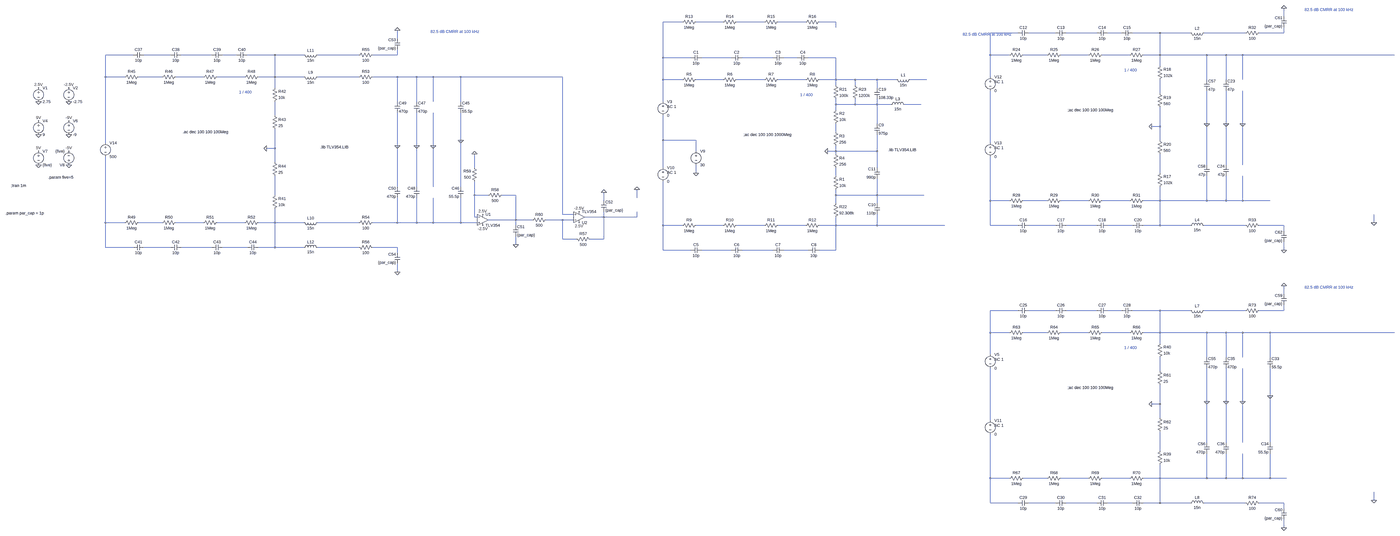
[diagram p0: schematic redirect_ratio_analysis_ac.asc, whole sheet]
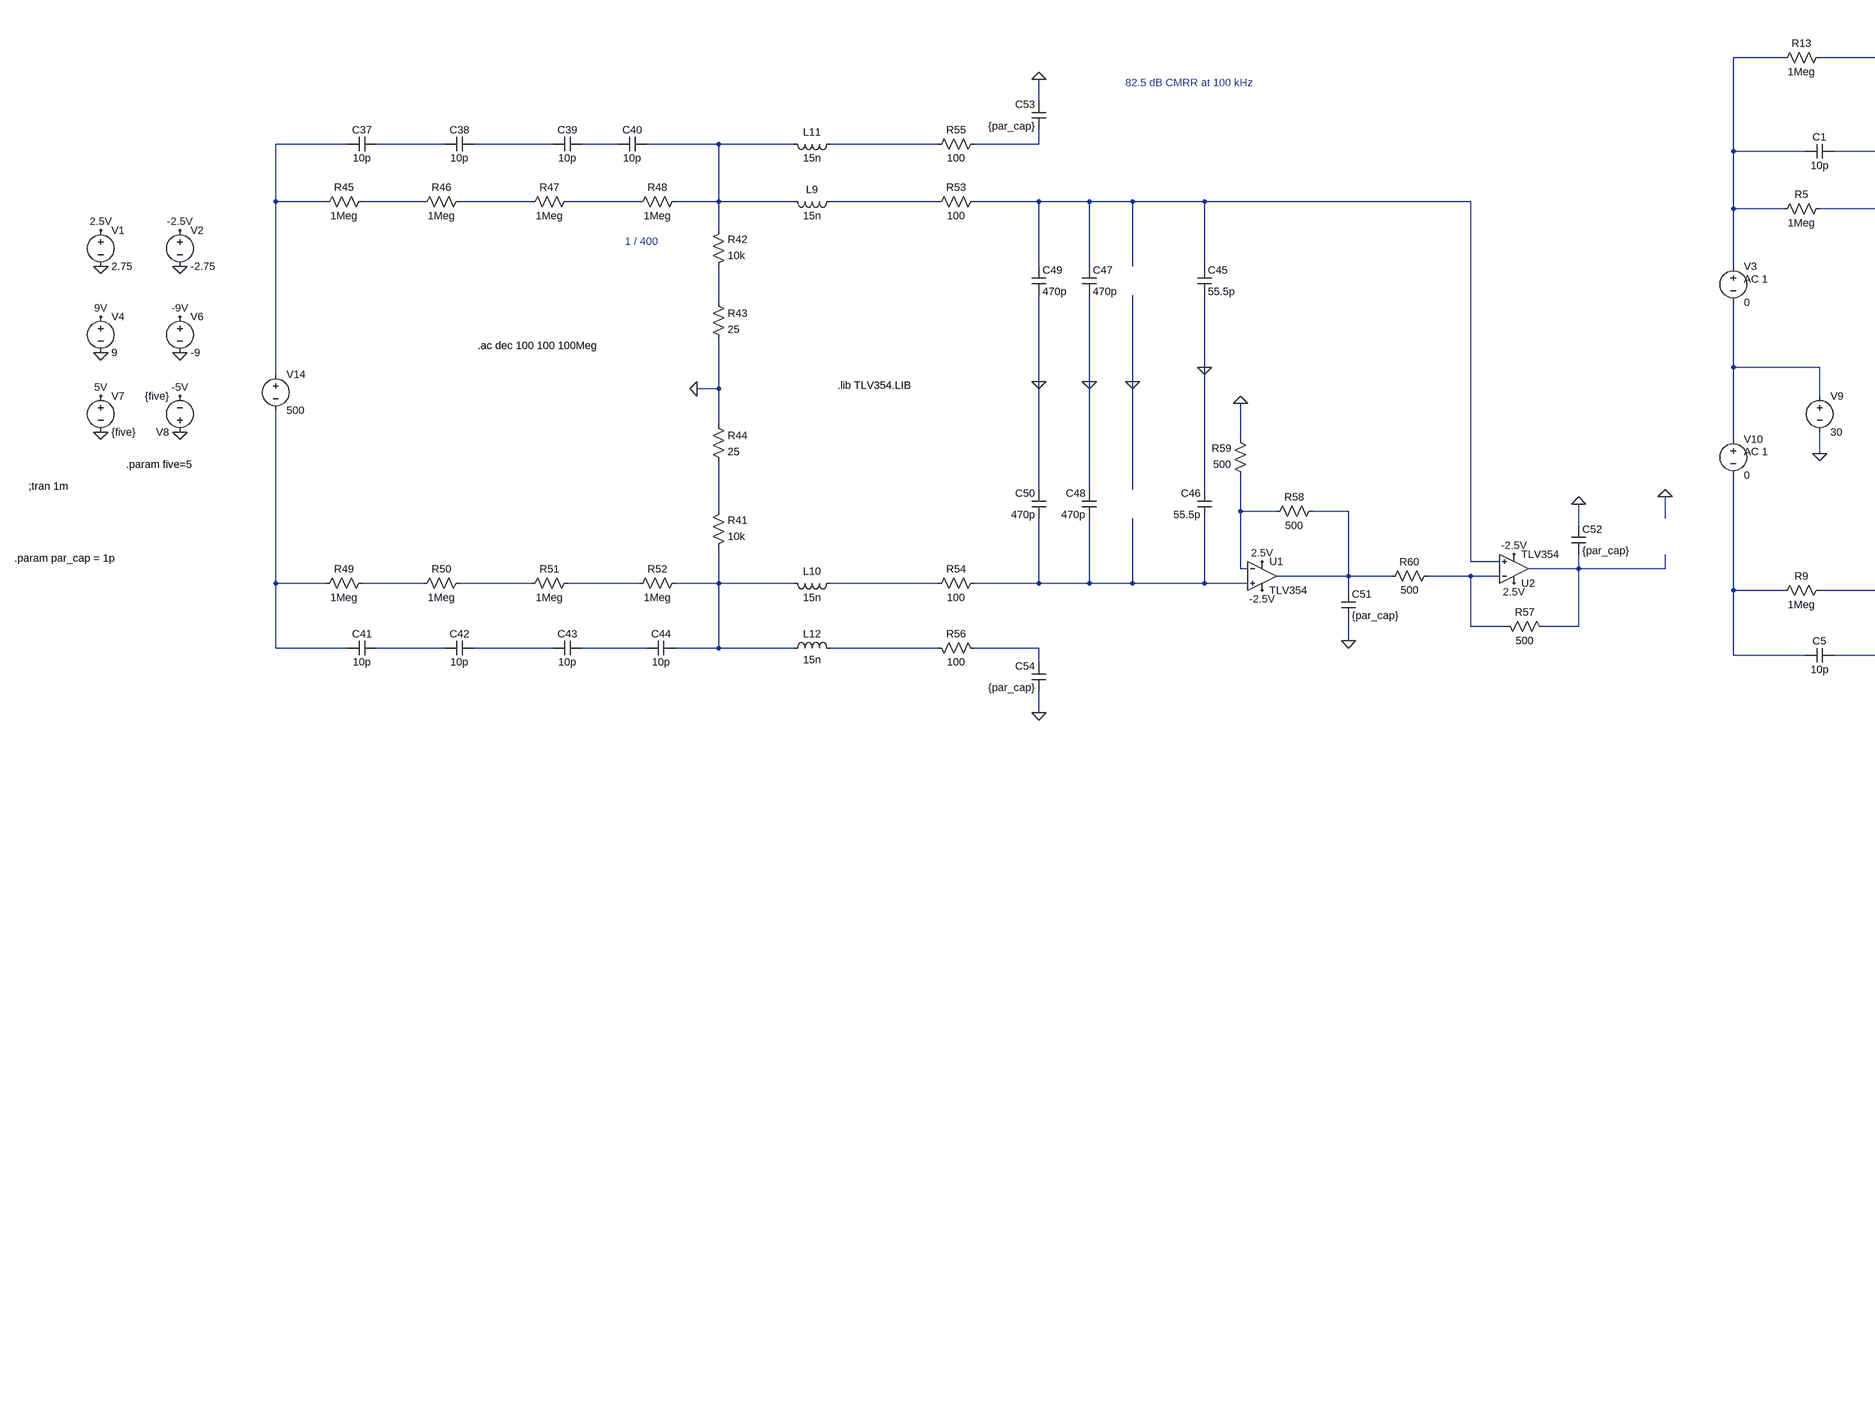
[diagram p1: schematic redirect_ratio_analysis_ac.asc, part, row 1 of 1, column 1 of 2]
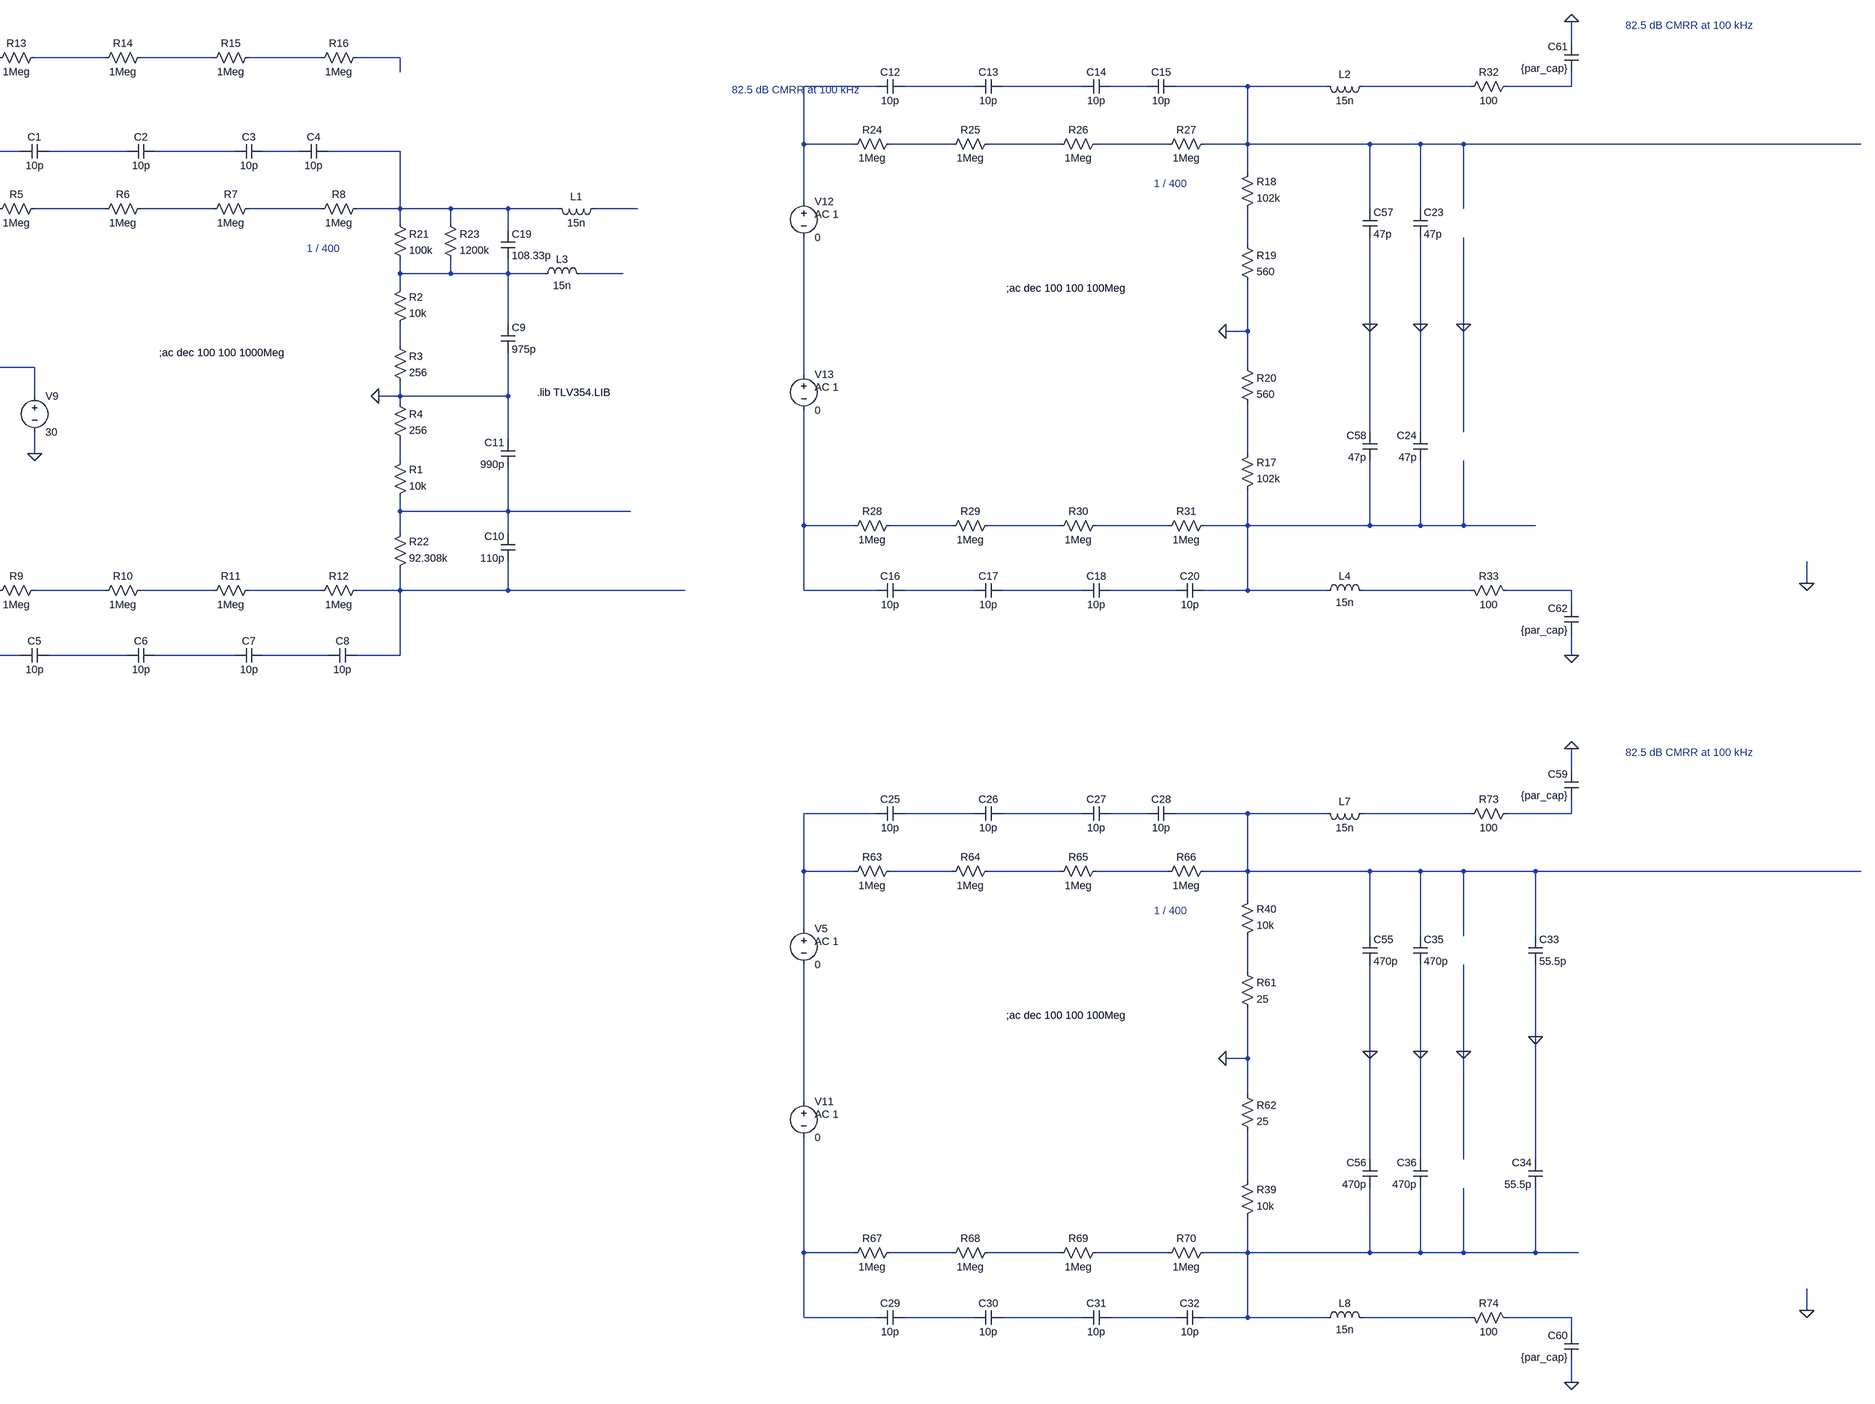
[diagram p2: schematic redirect_ratio_analysis_ac.asc, part, row 1 of 1, column 2 of 2]
redirect_ratio_analysis_ac.asc, the LTspice schematic file:
Version 4
SHEET 1 9060 2628
WIRE 7648 -672 7648 -720
WIRE 3888 -640 3776 -640
WIRE 4128 -640 3968 -640
WIRE 4368 -640 4208 -640
WIRE 4608 -640 4448 -640
WIRE 4784 -640 4688 -640
WIRE 4784 -608 4784 -640
WIRE 6048 -576 5888 -576
WIRE 6288 -576 6112 -576
WIRE 6528 -576 6352 -576
WIRE 6672 -576 6592 -576
WIRE 6896 -576 6736 -576
WIRE 7104 -576 6896 -576
WIRE 7424 -576 7184 -576
WIRE 7648 -576 7648 -608
WIRE 7648 -576 7504 -576
WIRE 2144 -544 2144 -592
WIRE 544 -448 384 -448
WIRE 784 -448 608 -448
WIRE 1024 -448 848 -448
WIRE 1168 -448 1088 -448
WIRE 1392 -448 1232 -448
WIRE 1600 -448 1392 -448
WIRE 1920 -448 1680 -448
WIRE 2144 -448 2144 -480
WIRE 2144 -448 2000 -448
WIRE 5888 -448 5888 -576
WIRE 6000 -448 5888 -448
WIRE 6240 -448 6080 -448
WIRE 6480 -448 6320 -448
WIRE 6720 -448 6560 -448
WIRE 6896 -448 6896 -576
WIRE 6896 -448 6800 -448
WIRE 7200 -448 6896 -448
WIRE 7312 -448 7200 -448
WIRE 7408 -448 7312 -448
WIRE 8608 -448 7408 -448
WIRE 3776 -432 3776 -640
WIRE 3936 -432 3776 -432
WIRE 4176 -432 4000 -432
WIRE 4416 -432 4240 -432
WIRE 4560 -432 4480 -432
WIRE 4784 -432 4624 -432
WIRE 6896 -384 6896 -448
WIRE 384 -320 384 -448
WIRE 496 -320 384 -320
WIRE 736 -320 576 -320
WIRE 976 -320 816 -320
WIRE 1216 -320 1056 -320
WIRE 1392 -320 1392 -448
WIRE 1392 -320 1296 -320
WIRE 1600 -320 1392 -320
WIRE 1920 -320 1680 -320
WIRE 2144 -320 2000 -320
WIRE 2256 -320 2144 -320
WIRE 2352 -320 2256 -320
WIRE 2512 -320 2352 -320
WIRE 3104 -320 2512 -320
WIRE 5888 -320 5888 -448
WIRE 3776 -304 3776 -432
WIRE 3888 -304 3776 -304
WIRE 4128 -304 3968 -304
WIRE 4368 -304 4208 -304
WIRE 4608 -304 4448 -304
WIRE 4784 -304 4784 -432
WIRE 4784 -304 4688 -304
WIRE 4896 -304 4784 -304
WIRE 5024 -304 4896 -304
WIRE 5136 -304 5024 -304
WIRE 5312 -304 5216 -304
WIRE 7200 -304 7200 -448
WIRE 7312 -304 7312 -448
WIRE 7408 -304 7408 -448
WIRE 4784 -272 4784 -304
WIRE 4896 -272 4896 -304
WIRE 1392 -256 1392 -320
WIRE 5024 -256 5024 -304
WIRE 6896 -224 6896 -304
WIRE 2144 -176 2144 -320
WIRE 2256 -176 2256 -320
WIRE 2352 -176 2352 -320
WIRE 2512 -176 2512 -320
WIRE 3776 -176 3776 -304
WIRE 4784 -160 4784 -192
WIRE 4896 -160 4896 -192
WIRE 4896 -160 4784 -160
WIRE 5024 -160 5024 -192
WIRE 5024 -160 4896 -160
WIRE 5104 -160 5024 -160
WIRE 5280 -160 5184 -160
WIRE 4784 -128 4784 -160
WIRE 1392 -96 1392 -176
WIRE 5024 -48 5024 -160
WIRE 7200 -48 7200 -240
WIRE 7312 -48 7312 -240
WIRE 7408 -48 7408 -240
WIRE 6896 -32 6896 -144
WIRE 6896 -32 6848 -32
WIRE 4784 0 4784 -48
WIRE 2512 48 2512 -112
WIRE 3776 48 3776 -96
WIRE 3968 48 3776 48
WIRE 6896 48 6896 -32
WIRE 384 64 384 -320
WIRE 5888 64 5888 -240
WIRE 2144 80 2144 -112
WIRE 2256 80 2256 -112
WIRE 2352 80 2352 -112
WIRE 1392 96 1392 -16
WIRE 1392 96 1344 96
WIRE 3968 112 3968 48
WIRE 4784 112 4784 80
WIRE 4784 112 4736 112
WIRE 5024 112 5024 16
WIRE 5024 112 4784 112
WIRE 4784 128 4784 112
WIRE 1392 176 1392 96
WIRE 7200 192 7200 -48
WIRE 7312 192 7312 -48
WIRE 7408 192 7408 -48
WIRE 2592 208 2592 128
WIRE 3776 208 3776 48
WIRE 5024 208 5024 112
WIRE 3968 240 3968 192
WIRE 6896 240 6896 128
WIRE 4784 256 4784 208
WIRE 2144 320 2144 80
WIRE 2256 320 2256 80
WIRE 2352 320 2352 80
WIRE 2512 320 2512 48
WIRE 1392 368 1392 256
WIRE 2592 368 2592 288
WIRE 2672 368 2592 368
WIRE 2832 368 2752 368
WIRE 4784 368 4784 336
WIRE 5024 368 5024 272
WIRE 5024 368 4784 368
WIRE 5296 368 5024 368
WIRE 3536 384 3536 336
WIRE 3344 400 3344 352
WIRE 5888 400 5888 144
WIRE 6000 400 5888 400
WIRE 6240 400 6080 400
WIRE 6480 400 6320 400
WIRE 6720 400 6560 400
WIRE 6896 400 6896 320
WIRE 6896 400 6800 400
WIRE 7200 400 7200 256
WIRE 7200 400 6896 400
WIRE 7312 400 7312 256
WIRE 7312 400 7200 400
WIRE 7408 400 7408 256
WIRE 7408 400 7312 400
WIRE 7568 400 7408 400
WIRE 4784 416 4784 368
WIRE 5024 416 5024 368
WIRE 3104 480 3104 -320
WIRE 3168 480 3104 480
WIRE 2592 496 2592 368
WIRE 2608 496 2592 496
WIRE 3344 496 3344 464
WIRE 3344 496 3232 496
WIRE 3536 496 3536 464
WIRE 3536 496 3344 496
WIRE 2832 512 2832 368
WIRE 2832 512 2672 512
WIRE 2928 512 2832 512
WIRE 3104 512 3008 512
WIRE 3168 512 3104 512
WIRE 384 528 384 144
WIRE 496 528 384 528
WIRE 736 528 576 528
WIRE 976 528 816 528
WIRE 1216 528 1056 528
WIRE 1392 528 1392 448
WIRE 1392 528 1296 528
WIRE 1600 528 1392 528
WIRE 1920 528 1680 528
WIRE 2144 528 2144 384
WIRE 2144 528 2000 528
WIRE 2256 528 2256 384
WIRE 2256 528 2144 528
WIRE 2352 528 2352 384
WIRE 2352 528 2256 528
WIRE 2512 528 2512 384
WIRE 2512 528 2352 528
WIRE 2608 528 2512 528
WIRE 8336 528 8336 480
WIRE 2832 544 2832 512
WIRE 3776 544 3776 288
WIRE 3888 544 3776 544
WIRE 4128 544 3968 544
WIRE 4368 544 4208 544
WIRE 4608 544 4448 544
WIRE 4784 544 4784 496
WIRE 4784 544 4688 544
WIRE 5024 544 5024 480
WIRE 5024 544 4784 544
WIRE 5424 544 5024 544
WIRE 5888 544 5888 400
WIRE 6048 544 5888 544
WIRE 6288 544 6112 544
WIRE 6528 544 6352 544
WIRE 6736 544 6592 544
WIRE 6896 544 6896 400
WIRE 6896 544 6800 544
WIRE 7104 544 6896 544
WIRE 7424 544 7184 544
WIRE 7648 544 7504 544
WIRE 7648 576 7648 544
WIRE 3104 624 3104 512
WIRE 3184 624 3104 624
WIRE 3344 624 3344 496
WIRE 3344 624 3264 624
WIRE 2832 656 2832 608
WIRE 384 672 384 528
WIRE 544 672 384 672
WIRE 784 672 608 672
WIRE 1024 672 848 672
WIRE 1232 672 1088 672
WIRE 1392 672 1392 528
WIRE 1392 672 1296 672
WIRE 1600 672 1392 672
WIRE 1920 672 1680 672
WIRE 2144 672 2000 672
WIRE 3776 688 3776 544
WIRE 3936 688 3776 688
WIRE 4176 688 4000 688
WIRE 4416 688 4240 688
WIRE 4624 688 4480 688
WIRE 4784 688 4784 544
WIRE 4784 688 4688 688
WIRE 7648 688 7648 640
WIRE 2144 704 2144 672
WIRE 2144 816 2144 768
WIRE 7648 944 7648 896
WIRE 6048 1040 5888 1040
WIRE 6288 1040 6112 1040
WIRE 6528 1040 6352 1040
WIRE 6672 1040 6592 1040
WIRE 6896 1040 6736 1040
WIRE 7104 1040 6896 1040
WIRE 7424 1040 7184 1040
WIRE 7648 1040 7648 1008
WIRE 7648 1040 7504 1040
WIRE 5888 1168 5888 1040
WIRE 6000 1168 5888 1168
WIRE 6240 1168 6080 1168
WIRE 6480 1168 6320 1168
WIRE 6720 1168 6560 1168
WIRE 6896 1168 6896 1040
WIRE 6896 1168 6800 1168
WIRE 7200 1168 6896 1168
WIRE 7312 1168 7200 1168
WIRE 7408 1168 7312 1168
WIRE 7568 1168 7408 1168
WIRE 8608 1168 7568 1168
WIRE 6896 1232 6896 1168
WIRE 5888 1296 5888 1168
WIRE 7200 1312 7200 1168
WIRE 7312 1312 7312 1168
WIRE 7408 1312 7408 1168
WIRE 7568 1312 7568 1168
WIRE 6896 1392 6896 1312
WIRE 7568 1536 7568 1376
WIRE 7200 1568 7200 1376
WIRE 7312 1568 7312 1376
WIRE 7408 1568 7408 1376
WIRE 6896 1584 6896 1472
WIRE 6896 1584 6848 1584
WIRE 6896 1664 6896 1584
WIRE 5888 1680 5888 1376
WIRE 7200 1808 7200 1568
WIRE 7312 1808 7312 1568
WIRE 7408 1808 7408 1568
WIRE 7568 1808 7568 1536
WIRE 6896 1856 6896 1744
WIRE 5888 2016 5888 1760
WIRE 6000 2016 5888 2016
WIRE 6240 2016 6080 2016
WIRE 6480 2016 6320 2016
WIRE 6720 2016 6560 2016
WIRE 6896 2016 6896 1936
WIRE 6896 2016 6800 2016
WIRE 7200 2016 7200 1872
WIRE 7200 2016 6896 2016
WIRE 7312 2016 7312 1872
WIRE 7312 2016 7200 2016
WIRE 7408 2016 7408 1872
WIRE 7408 2016 7312 2016
WIRE 7568 2016 7568 1872
WIRE 7568 2016 7408 2016
WIRE 7664 2016 7568 2016
WIRE 8336 2144 8336 2096
WIRE 5888 2160 5888 2016
WIRE 6048 2160 5888 2160
WIRE 6288 2160 6112 2160
WIRE 6528 2160 6352 2160
WIRE 6736 2160 6592 2160
WIRE 6896 2160 6896 2016
WIRE 6896 2160 6800 2160
WIRE 7104 2160 6896 2160
WIRE 7424 2160 7184 2160
WIRE 7648 2160 7504 2160
WIRE 7648 2192 7648 2160
WIRE 7648 2304 7648 2256
FLAG -80 -176 0
FLAG -80 -256 2.5V
FLAG 96 -176 0
FLAG 96 -256 -2.5V
FLAG -80 16 0
FLAG -80 -64 9V
FLAG 96 16 0
FLAG 96 -64 -9V
FLAG -80 192 0
FLAG -80 112 5V
FLAG 96 192 0
FLAG 96 112 -5V
FLAG 1344 96 0
FLAG 2352 80 0
FLAG 2512 48 0
FLAG 3200 528 2.5V
FLAG 3200 464 -2.5V
FLAG 2256 80 0
FLAG 2640 480 2.5V
FLAG 2640 544 -2.5V
FLAG 2144 80 0
FLAG 2832 656 0
FLAG 3344 352 0
FLAG 2144 -592 0
FLAG 2144 816 0
FLAG 3536 336 0
FLAG 2592 128 0
FLAG 4736 112 0
FLAG 3968 240 0
FLAG 6848 1584 0
FLAG 7408 1568 0
FLAG 7568 1536 0
FLAG 7312 1568 0
FLAG 7200 1568 0
FLAG 8336 2144 0
FLAG 7648 896 0
FLAG 7648 2304 0
FLAG 6848 -32 0
FLAG 7408 -48 0
FLAG 7312 -48 0
FLAG 7200 -48 0
FLAG 8336 528 0
FLAG 7648 -720 0
FLAG 7648 688 0
SYMBOL voltage -80 -272 R0
SYMATTR InstName V1
SYMATTR Value 2.75
SYMBOL voltage 96 -272 R0
SYMATTR InstName V2
SYMATTR Value -2.75
SYMBOL voltage -80 -80 R0
SYMATTR InstName V4
SYMATTR Value 9
SYMBOL voltage 96 -80 R0
SYMATTR InstName V6
SYMATTR Value -9
SYMBOL voltage -80 96 R0
SYMATTR InstName V7
SYMATTR Value {five}
SYMBOL voltage 96 208 R180
WINDOW 123 0 0 Left 0
WINDOW 39 0 0 Left 0
SYMATTR InstName V8
SYMATTR Value {five}
SYMBOL res 1376 464 M180
WINDOW 0 36 76 Left 2
WINDOW 3 36 40 Left 2
SYMATTR InstName R41
SYMATTR Value 10k
SYMBOL cap 608 -464 R90
WINDOW 0 0 32 VBottom 2
WINDOW 3 32 32 VTop 2
SYMATTR InstName C37
SYMATTR Value 10p
SYMBOL cap 848 -464 R90
WINDOW 0 0 32 VBottom 2
WINDOW 3 32 32 VTop 2
SYMATTR InstName C38
SYMATTR Value 10p
SYMBOL cap 1088 -464 R90
WINDOW 0 0 32 VBottom 2
WINDOW 3 32 32 VTop 2
SYMATTR InstName C39
SYMATTR Value 10p
SYMBOL cap 1232 -464 R90
WINDOW 0 0 32 VBottom 2
WINDOW 3 32 32 VTop 2
SYMATTR InstName C40
SYMATTR Value 10p
SYMBOL cap 608 656 R90
WINDOW 0 0 32 VBottom 2
WINDOW 3 32 32 VTop 2
SYMATTR InstName C41
SYMATTR Value 10p
SYMBOL cap 848 656 R90
WINDOW 0 0 32 VBottom 2
WINDOW 3 32 32 VTop 2
SYMATTR InstName C42
SYMATTR Value 10p
SYMBOL cap 1088 656 R90
WINDOW 0 0 32 VBottom 2
WINDOW 3 32 32 VTop 2
SYMATTR InstName C43
SYMATTR Value 10p
SYMBOL cap 1296 656 R90
WINDOW 0 0 32 VBottom 2
WINDOW 3 32 32 VTop 2
SYMATTR InstName C44
SYMATTR Value 10p
SYMBOL cap 2496 -176 R0
SYMATTR InstName C45
SYMATTR Value 55.5p
SYMBOL cap 2528 384 R180
WINDOW 0 24 56 Left 2
WINDOW 3 24 8 Left 2
SYMATTR InstName C46
SYMATTR Value 55.5p
SYMBOL res 1376 -160 M180
WINDOW 0 36 76 Left 2
WINDOW 3 36 40 Left 2
SYMATTR InstName R42
SYMATTR Value 10k
SYMBOL voltage 384 48 R0
WINDOW 123 0 0 Left 0
WINDOW 39 0 0 Left 0
SYMATTR InstName V14
SYMATTR Value 500
SYMBOL cap 2240 -176 R0
SYMATTR InstName C47
SYMATTR Value 470p
SYMBOL cap 2272 384 R180
WINDOW 0 24 56 Left 2
WINDOW 3 24 8 Left 2
SYMATTR InstName C48
SYMATTR Value 470p
SYMBOL res 1376 -112 R0
SYMATTR InstName R43
SYMATTR Value 25
SYMBOL res 1376 160 R0
SYMATTR InstName R44
SYMATTR Value 25
SYMBOL cap 2128 -176 R0
SYMATTR InstName C49
SYMATTR Value 470p
SYMBOL cap 2160 384 R180
WINDOW 0 24 56 Left 2
WINDOW 3 24 8 Left 2
SYMATTR InstName C50
SYMATTR Value 470p
SYMBOL cap 2816 544 R0
SYMATTR InstName C51
SYMATTR Value {par_cap}
SYMBOL cap 3328 464 M180
WINDOW 0 24 56 Left 2
WINDOW 3 24 8 Left 2
SYMATTR InstName C52
SYMATTR Value {par_cap}
SYMBOL ind 1696 -336 R90
WINDOW 0 5 56 VBottom 2
WINDOW 3 32 56 VTop 2
SYMATTR InstName L9
SYMATTR Value 15n
SYMBOL res 592 -336 R90
WINDOW 0 0 56 VBottom 2
WINDOW 3 32 56 VTop 2
SYMATTR InstName R45
SYMATTR Value 1Meg
SYMBOL res 832 -336 R90
WINDOW 0 0 56 VBottom 2
WINDOW 3 32 56 VTop 2
SYMATTR InstName R46
SYMATTR Value 1Meg
SYMBOL res 1072 -336 R90
WINDOW 0 0 56 VBottom 2
WINDOW 3 32 56 VTop 2
SYMATTR InstName R47
SYMATTR Value 1Meg
SYMBOL res 1312 -336 R90
WINDOW 0 0 56 VBottom 2
WINDOW 3 32 56 VTop 2
SYMATTR InstName R48
SYMATTR Value 1Meg
SYMBOL res 592 512 R90
WINDOW 0 0 56 VBottom 2
WINDOW 3 32 56 VTop 2
SYMATTR InstName R49
SYMATTR Value 1Meg
SYMBOL res 832 512 R90
WINDOW 0 0 56 VBottom 2
WINDOW 3 32 56 VTop 2
SYMATTR InstName R50
SYMATTR Value 1Meg
SYMBOL res 1072 512 R90
WINDOW 0 0 56 VBottom 2
WINDOW 3 32 56 VTop 2
SYMATTR InstName R51
SYMATTR Value 1Meg
SYMBOL res 1312 512 R90
WINDOW 0 0 56 VBottom 2
WINDOW 3 32 56 VTop 2
SYMATTR InstName R52
SYMATTR Value 1Meg
SYMBOL ind 1696 512 R90
WINDOW 0 5 56 VBottom 2
WINDOW 3 32 56 VTop 2
SYMATTR InstName L10
SYMATTR Value 15n
SYMBOL res 2016 -336 R90
WINDOW 0 0 56 VBottom 2
WINDOW 3 32 56 VTop 2
SYMATTR InstName R53
SYMATTR Value 100
SYMBOL res 2016 512 R90
WINDOW 0 0 56 VBottom 2
WINDOW 3 32 56 VTop 2
SYMATTR InstName R54
SYMATTR Value 100
SYMBOL ind 1696 -464 R90
WINDOW 0 5 56 VBottom 2
WINDOW 3 32 56 VTop 2
SYMATTR InstName L11
SYMATTR Value 15n
SYMBOL res 2016 -464 R90
WINDOW 0 0 56 VBottom 2
WINDOW 3 32 56 VTop 2
SYMATTR InstName R55
SYMATTR Value 100
SYMBOL cap 2160 -480 R180
WINDOW 0 24 56 Left 2
WINDOW 3 24 8 Left 2
SYMATTR InstName C53
SYMATTR Value {par_cap}
SYMBOL ind 1696 688 M270
WINDOW 0 32 56 VTop 2
WINDOW 3 5 56 VBottom 2
SYMATTR InstName L12
SYMATTR Value 15n
SYMBOL res 2016 688 M270
WINDOW 0 32 56 VTop 2
WINDOW 3 0 56 VBottom 2
SYMATTR InstName R56
SYMATTR Value 100
SYMBOL cap 2160 704 M0
SYMATTR InstName C54
SYMATTR Value {par_cap}
SYMBOL res 3280 640 M270
WINDOW 0 32 56 VTop 2
WINDOW 3 0 56 VBottom 2
SYMATTR InstName R57
SYMATTR Value 500
SYMBOL res 2768 352 R90
WINDOW 0 0 56 VBottom 2
WINDOW 3 32 56 VTop 2
SYMATTR InstName R58
SYMATTR Value 500
SYMBOL res 2608 304 R180
WINDOW 0 36 76 Left 2
WINDOW 3 36 40 Left 2
SYMATTR InstName R59
SYMATTR Value 500
SYMBOL res 3024 496 R90
WINDOW 0 0 56 VBottom 2
WINDOW 3 32 56 VTop 2
SYMATTR InstName R60
SYMATTR Value 500
SYMBOL OpAmps\\opamp2 2640 448 R0
SYMATTR InstName U1
SYMATTR Value TLV354
SYMBOL OpAmps\\opamp2 3200 560 M180
SYMATTR InstName U2
SYMATTR Value TLV354
SYMBOL res 4768 352 M180
WINDOW 0 36 76 Left 2
WINDOW 3 36 40 Left 2
SYMATTR InstName R1
SYMATTR Value 10k
SYMBOL cap 4000 -448 R90
WINDOW 0 0 32 VBottom 2
WINDOW 3 32 32 VTop 2
SYMATTR InstName C1
SYMATTR Value 10p
SYMBOL cap 4240 -448 R90
WINDOW 0 0 32 VBottom 2
WINDOW 3 32 32 VTop 2
SYMATTR InstName C2
SYMATTR Value 10p
SYMBOL cap 4480 -448 R90
WINDOW 0 0 32 VBottom 2
WINDOW 3 32 32 VTop 2
SYMATTR InstName C3
SYMATTR Value 10p
SYMBOL cap 4624 -448 R90
WINDOW 0 0 32 VBottom 2
WINDOW 3 32 32 VTop 2
SYMATTR InstName C4
SYMATTR Value 10p
SYMBOL cap 4000 672 R90
WINDOW 0 0 32 VBottom 2
WINDOW 3 32 32 VTop 2
SYMATTR InstName C5
SYMATTR Value 10p
SYMBOL cap 4240 672 R90
WINDOW 0 0 32 VBottom 2
WINDOW 3 32 32 VTop 2
SYMATTR InstName C6
SYMATTR Value 10p
SYMBOL cap 4480 672 R90
WINDOW 0 0 32 VBottom 2
WINDOW 3 32 32 VTop 2
SYMATTR InstName C7
SYMATTR Value 10p
SYMBOL cap 4688 672 R90
WINDOW 0 0 32 VBottom 2
WINDOW 3 32 32 VTop 2
SYMATTR InstName C8
SYMATTR Value 10p
SYMBOL res 4768 -32 M180
WINDOW 0 36 76 Left 2
WINDOW 3 36 40 Left 2
SYMATTR InstName R2
SYMATTR Value 10k
SYMBOL voltage 3776 -192 R0
WINDOW 123 24 44 Left 2
WINDOW 39 0 0 Left 0
SYMATTR Value2 AC 1
SYMATTR InstName V3
SYMATTR Value 0
SYMBOL res 4768 -16 R0
SYMATTR InstName R3
SYMATTR Value 256
SYMBOL ind 5232 -320 R90
WINDOW 0 5 56 VBottom 2
WINDOW 3 32 56 VTop 2
SYMATTR InstName L1
SYMATTR Value 15n
SYMBOL res 3984 -320 R90
WINDOW 0 0 56 VBottom 2
WINDOW 3 32 56 VTop 2
SYMATTR InstName R5
SYMATTR Value 1Meg
SYMBOL res 4224 -320 R90
WINDOW 0 0 56 VBottom 2
WINDOW 3 32 56 VTop 2
SYMATTR InstName R6
SYMATTR Value 1Meg
SYMBOL res 4464 -320 R90
WINDOW 0 0 56 VBottom 2
WINDOW 3 32 56 VTop 2
SYMATTR InstName R7
SYMATTR Value 1Meg
SYMBOL res 4704 -320 R90
WINDOW 0 0 56 VBottom 2
WINDOW 3 32 56 VTop 2
SYMATTR InstName R8
SYMATTR Value 1Meg
SYMBOL res 3984 528 R90
WINDOW 0 0 56 VBottom 2
WINDOW 3 32 56 VTop 2
SYMATTR InstName R9
SYMATTR Value 1Meg
SYMBOL res 4224 528 R90
WINDOW 0 0 56 VBottom 2
WINDOW 3 32 56 VTop 2
SYMATTR InstName R10
SYMATTR Value 1Meg
SYMBOL res 4464 528 R90
WINDOW 0 0 56 VBottom 2
WINDOW 3 32 56 VTop 2
SYMATTR InstName R11
SYMATTR Value 1Meg
SYMBOL res 4704 528 R90
WINDOW 0 0 56 VBottom 2
WINDOW 3 32 56 VTop 2
SYMATTR InstName R12
SYMATTR Value 1Meg
SYMBOL ind 5200 -144 M270
WINDOW 0 32 56 VTop 2
WINDOW 3 5 56 VBottom 2
SYMATTR InstName L3
SYMATTR Value 15n
SYMBOL voltage 3968 96 R0
WINDOW 123 0 0 Left 0
WINDOW 39 0 0 Left 0
SYMATTR InstName V9
SYMATTR Value 30
SYMBOL res 4768 112 R0
SYMATTR InstName R4
SYMATTR Value 256
SYMBOL res 4768 512 M180
WINDOW 0 36 76 Left 2
WINDOW 3 36 40 Left 2
SYMATTR InstName R22
SYMATTR Value 92.308k
SYMBOL res 4768 -288 R0
SYMATTR InstName R21
SYMATTR Value 100k
SYMBOL res 4880 -288 R0
SYMATTR InstName R23
SYMATTR Value 1200k
SYMBOL cap 5008 -256 R0
SYMATTR InstName C19
SYMATTR Value 108.33p
SYMBOL cap 5008 -48 R0
SYMATTR InstName C9
SYMATTR Value 975p
SYMBOL cap 5040 480 R180
WINDOW 0 24 56 Left 2
WINDOW 3 24 8 Left 2
SYMATTR InstName C10
SYMATTR Value 110p
SYMBOL cap 5040 272 R180
WINDOW 0 24 56 Left 2
WINDOW 3 24 8 Left 2
SYMATTR InstName C11
SYMATTR Value 990p
SYMBOL voltage 3776 192 R0
WINDOW 123 24 44 Left 2
WINDOW 39 0 0 Left 0
SYMATTR Value2 AC 1
SYMATTR InstName V10
SYMATTR Value 0
SYMBOL res 3984 -656 R90
WINDOW 0 0 56 VBottom 2
WINDOW 3 32 56 VTop 2
SYMATTR InstName R13
SYMATTR Value 1Meg
SYMBOL res 4224 -656 R90
WINDOW 0 0 56 VBottom 2
WINDOW 3 32 56 VTop 2
SYMATTR InstName R14
SYMATTR Value 1Meg
SYMBOL res 4464 -656 R90
WINDOW 0 0 56 VBottom 2
WINDOW 3 32 56 VTop 2
SYMATTR InstName R15
SYMATTR Value 1Meg
SYMBOL res 4704 -656 R90
WINDOW 0 0 56 VBottom 2
WINDOW 3 32 56 VTop 2
SYMATTR InstName R16
SYMATTR Value 1Meg
SYMBOL res 6880 1952 M180
WINDOW 0 36 76 Left 2
WINDOW 3 36 40 Left 2
SYMATTR InstName R39
SYMATTR Value 10k
SYMBOL cap 6112 1024 R90
WINDOW 0 0 32 VBottom 2
WINDOW 3 32 32 VTop 2
SYMATTR InstName C25
SYMATTR Value 10p
SYMBOL cap 6352 1024 R90
WINDOW 0 0 32 VBottom 2
WINDOW 3 32 32 VTop 2
SYMATTR InstName C26
SYMATTR Value 10p
SYMBOL cap 6592 1024 R90
WINDOW 0 0 32 VBottom 2
WINDOW 3 32 32 VTop 2
SYMATTR InstName C27
SYMATTR Value 10p
SYMBOL cap 6736 1024 R90
WINDOW 0 0 32 VBottom 2
WINDOW 3 32 32 VTop 2
SYMATTR InstName C28
SYMATTR Value 10p
SYMBOL cap 6112 2144 R90
WINDOW 0 0 32 VBottom 2
WINDOW 3 32 32 VTop 2
SYMATTR InstName C29
SYMATTR Value 10p
SYMBOL cap 6352 2144 R90
WINDOW 0 0 32 VBottom 2
WINDOW 3 32 32 VTop 2
SYMATTR InstName C30
SYMATTR Value 10p
SYMBOL cap 6592 2144 R90
WINDOW 0 0 32 VBottom 2
WINDOW 3 32 32 VTop 2
SYMATTR InstName C31
SYMATTR Value 10p
SYMBOL cap 6800 2144 R90
WINDOW 0 0 32 VBottom 2
WINDOW 3 32 32 VTop 2
SYMATTR InstName C32
SYMATTR Value 10p
SYMBOL cap 7552 1312 R0
SYMATTR InstName C33
SYMATTR Value 55.5p
SYMBOL cap 7584 1872 R180
WINDOW 0 24 56 Left 2
WINDOW 3 24 8 Left 2
SYMATTR InstName C34
SYMATTR Value 55.5p
SYMBOL res 6880 1328 M180
WINDOW 0 36 76 Left 2
WINDOW 3 36 40 Left 2
SYMATTR InstName R40
SYMATTR Value 10k
SYMBOL cap 7296 1312 R0
SYMATTR InstName C35
SYMATTR Value 470p
SYMBOL cap 7328 1872 R180
WINDOW 0 24 56 Left 2
WINDOW 3 24 8 Left 2
SYMATTR InstName C36
SYMATTR Value 470p
SYMBOL res 6880 1376 R0
SYMATTR InstName R61
SYMATTR Value 25
SYMBOL res 6880 1648 R0
SYMATTR InstName R62
SYMATTR Value 25
SYMBOL cap 7184 1312 R0
SYMATTR InstName C55
SYMATTR Value 470p
SYMBOL cap 7216 1872 R180
WINDOW 0 24 56 Left 2
WINDOW 3 24 8 Left 2
SYMATTR InstName C56
SYMATTR Value 470p
SYMBOL res 6096 1152 R90
WINDOW 0 0 56 VBottom 2
WINDOW 3 32 56 VTop 2
SYMATTR InstName R63
SYMATTR Value 1Meg
SYMBOL res 6336 1152 R90
WINDOW 0 0 56 VBottom 2
WINDOW 3 32 56 VTop 2
SYMATTR InstName R64
SYMATTR Value 1Meg
SYMBOL res 6576 1152 R90
WINDOW 0 0 56 VBottom 2
WINDOW 3 32 56 VTop 2
SYMATTR InstName R65
SYMATTR Value 1Meg
SYMBOL res 6816 1152 R90
WINDOW 0 0 56 VBottom 2
WINDOW 3 32 56 VTop 2
SYMATTR InstName R66
SYMATTR Value 1Meg
SYMBOL res 6096 2000 R90
WINDOW 0 0 56 VBottom 2
WINDOW 3 32 56 VTop 2
SYMATTR InstName R67
SYMATTR Value 1Meg
SYMBOL res 6336 2000 R90
WINDOW 0 0 56 VBottom 2
WINDOW 3 32 56 VTop 2
SYMATTR InstName R68
SYMATTR Value 1Meg
SYMBOL res 6576 2000 R90
WINDOW 0 0 56 VBottom 2
WINDOW 3 32 56 VTop 2
SYMATTR InstName R69
SYMATTR Value 1Meg
SYMBOL res 6816 2000 R90
WINDOW 0 0 56 VBottom 2
WINDOW 3 32 56 VTop 2
SYMATTR InstName R70
SYMATTR Value 1Meg
SYMBOL ind 7200 1024 R90
WINDOW 0 5 56 VBottom 2
WINDOW 3 32 56 VTop 2
SYMATTR InstName L7
SYMATTR Value 15n
SYMBOL res 7520 1024 R90
WINDOW 0 0 56 VBottom 2
WINDOW 3 32 56 VTop 2
SYMATTR InstName R73
SYMATTR Value 100
SYMBOL cap 7664 1008 R180
WINDOW 0 24 56 Left 2
WINDOW 3 24 8 Left 2
SYMATTR InstName C59
SYMATTR Value {par_cap}
SYMBOL ind 7200 2176 M270
WINDOW 0 32 56 VTop 2
WINDOW 3 5 56 VBottom 2
SYMATTR InstName L8
SYMATTR Value 15n
SYMBOL res 7520 2176 M270
WINDOW 0 32 56 VTop 2
WINDOW 3 0 56 VBottom 2
SYMATTR InstName R74
SYMATTR Value 100
SYMBOL cap 7664 2192 M0
SYMATTR InstName C60
SYMATTR Value {par_cap}
SYMBOL voltage 5888 1280 R0
WINDOW 123 24 44 Left 2
WINDOW 39 0 0 Left 0
SYMATTR Value2 AC 1
SYMATTR InstName V5
SYMATTR Value 0
SYMBOL voltage 5888 1664 R0
WINDOW 123 24 44 Left 2
WINDOW 39 0 0 Left 0
SYMATTR Value2 AC 1
SYMATTR InstName V11
SYMATTR Value 0
SYMBOL res 6880 336 M180
WINDOW 0 36 76 Left 2
WINDOW 3 36 40 Left 2
SYMATTR InstName R17
SYMATTR Value 102k
SYMBOL cap 6112 -592 R90
WINDOW 0 0 32 VBottom 2
WINDOW 3 32 32 VTop 2
SYMATTR InstName C12
SYMATTR Value 10p
SYMBOL cap 6352 -592 R90
WINDOW 0 0 32 VBottom 2
WINDOW 3 32 32 VTop 2
SYMATTR InstName C13
SYMATTR Value 10p
SYMBOL cap 6592 -592 R90
WINDOW 0 0 32 VBottom 2
WINDOW 3 32 32 VTop 2
SYMATTR InstName C14
SYMATTR Value 10p
SYMBOL cap 6736 -592 R90
WINDOW 0 0 32 VBottom 2
WINDOW 3 32 32 VTop 2
SYMATTR InstName C15
SYMATTR Value 10p
SYMBOL cap 6112 528 R90
WINDOW 0 0 32 VBottom 2
WINDOW 3 32 32 VTop 2
SYMATTR InstName C16
SYMATTR Value 10p
SYMBOL cap 6352 528 R90
WINDOW 0 0 32 VBottom 2
WINDOW 3 32 32 VTop 2
SYMATTR InstName C17
SYMATTR Value 10p
SYMBOL cap 6592 528 R90
WINDOW 0 0 32 VBottom 2
WINDOW 3 32 32 VTop 2
SYMATTR InstName C18
SYMATTR Value 10p
SYMBOL cap 6800 528 R90
WINDOW 0 0 32 VBottom 2
WINDOW 3 32 32 VTop 2
SYMATTR InstName C20
SYMATTR Value 10p
SYMBOL res 6880 -288 M180
WINDOW 0 36 76 Left 2
WINDOW 3 36 40 Left 2
SYMATTR InstName R18
SYMATTR Value 102k
SYMBOL cap 7296 -304 R0
SYMATTR InstName C23
SYMATTR Value 47p
SYMBOL cap 7328 256 R180
WINDOW 0 24 56 Left 2
WINDOW 3 24 8 Left 2
SYMATTR InstName C24
SYMATTR Value 47p
SYMBOL res 6880 -240 R0
SYMATTR InstName R19
SYMATTR Value 560
SYMBOL res 6880 32 R0
SYMATTR InstName R20
SYMATTR Value 560
SYMBOL cap 7184 -304 R0
SYMATTR InstName C57
SYMATTR Value 47p
SYMBOL cap 7216 256 R180
WINDOW 0 24 56 Left 2
WINDOW 3 24 8 Left 2
SYMATTR InstName C58
SYMATTR Value 47p
SYMBOL res 6096 -464 R90
WINDOW 0 0 56 VBottom 2
WINDOW 3 32 56 VTop 2
SYMATTR InstName R24
SYMATTR Value 1Meg
SYMBOL res 6336 -464 R90
WINDOW 0 0 56 VBottom 2
WINDOW 3 32 56 VTop 2
SYMATTR InstName R25
SYMATTR Value 1Meg
SYMBOL res 6576 -464 R90
WINDOW 0 0 56 VBottom 2
WINDOW 3 32 56 VTop 2
SYMATTR InstName R26
SYMATTR Value 1Meg
SYMBOL res 6816 -464 R90
WINDOW 0 0 56 VBottom 2
WINDOW 3 32 56 VTop 2
SYMATTR InstName R27
SYMATTR Value 1Meg
SYMBOL res 6096 384 R90
WINDOW 0 0 56 VBottom 2
WINDOW 3 32 56 VTop 2
SYMATTR InstName R28
SYMATTR Value 1Meg
SYMBOL res 6336 384 R90
WINDOW 0 0 56 VBottom 2
WINDOW 3 32 56 VTop 2
SYMATTR InstName R29
SYMATTR Value 1Meg
SYMBOL res 6576 384 R90
WINDOW 0 0 56 VBottom 2
WINDOW 3 32 56 VTop 2
SYMATTR InstName R30
SYMATTR Value 1Meg
SYMBOL res 6816 384 R90
WINDOW 0 0 56 VBottom 2
WINDOW 3 32 56 VTop 2
SYMATTR InstName R31
SYMATTR Value 1Meg
SYMBOL ind 7200 -592 R90
WINDOW 0 5 56 VBottom 2
WINDOW 3 32 56 VTop 2
SYMATTR InstName L2
SYMATTR Value 15n
SYMBOL res 7520 -592 R90
WINDOW 0 0 56 VBottom 2
WINDOW 3 32 56 VTop 2
SYMATTR InstName R32
SYMATTR Value 100
SYMBOL cap 7664 -608 R180
WINDOW 0 24 56 Left 2
WINDOW 3 24 8 Left 2
SYMATTR InstName C61
SYMATTR Value {par_cap}
SYMBOL ind 7200 560 M270
WINDOW 0 32 56 VTop 2
WINDOW 3 5 56 VBottom 2
SYMATTR InstName L4
SYMATTR Value 15n
SYMBOL res 7520 560 M270
WINDOW 0 32 56 VTop 2
WINDOW 3 0 56 VBottom 2
SYMATTR InstName R33
SYMATTR Value 100
SYMBOL cap 7664 576 M0
SYMATTR InstName C62
SYMATTR Value {par_cap}
SYMBOL voltage 5888 -336 R0
WINDOW 123 24 44 Left 2
WINDOW 39 0 0 Left 0
SYMATTR Value2 AC 1
SYMATTR InstName V12
SYMATTR Value 0
SYMBOL voltage 5888 48 R0
WINDOW 123 24 44 Left 2
WINDOW 39 0 0 Left 0
SYMATTR Value2 AC 1
SYMATTR InstName V13
SYMATTR Value 0
TEXT -240 312 Left 2 !;tran 1m
TEXT -24 264 Left 2 !.param five=5
TEXT -272 472 Left 2 !.param par_cap = 1p
TEXT 1184 -232 Left 2 ;1 / 400
TEXT 2336 -584 Left 2 ;82.5 dB CMRR at 100 kHz
TEXT 856 0 Left 2 !.ac dec 100 100 100Meg
TEXT 1696 88 Left 2 !.lib TLV354.LIB
TEXT 4576 -216 Left 2 ;1 / 400
TEXT 5728 -568 Left 2 ;82.5 dB CMRR at 100 kHz
TEXT 4248 16 Left 2 !;ac dec 100 100 1000Meg
TEXT 5088 104 Left 2 !.lib TLV354.LIB
TEXT 6688 1256 Left 2 ;1 / 400
TEXT 7840 904 Left 2 ;82.5 dB CMRR at 100 kHz
TEXT 6360 1488 Left 2 !;ac dec 100 100 100Meg
TEXT 6688 -360 Left 2 ;1 / 400
TEXT 7840 -712 Left 2 ;82.5 dB CMRR at 100 kHz
TEXT 6360 -128 Left 2 !;ac dec 100 100 100Meg

The netlist it stands for:
* redirect_ratio_analysis_ac.asc
V1 2.5V 0 2.75
V2 -2.5V 0 -2.75
V4 9V 0 9
V6 -9V 0 -9
V7 5V 0 {five}
V8 0 -5V {five}
R41 N060 N045 10k
C37 N014 N013 10p
C38 N015 N014 10p
C39 N016 N015 10p
C40 N017 N016 10p
C41 N073 N056 10p
C42 N074 N073 10p
C43 N075 N074 10p
C44 N060 N075 10p
C45 N031 0 55.5p
C46 N062 0 55.5p
R42 N039 N017 10k
V14 N013 N056 500
C47 N031 0 470p
C48 N062 0 470p
R43 N039 0 25
R44 0 N045 25
C49 N031 0 470p
C50 N062 0 470p
C51 N047 0 {par_cap}
C52 N054 0 {par_cap}
L9 N030 N017 15n
R45 N027 N013 1Meg
R46 N028 N027 1Meg
R47 N029 N028 1Meg
R48 N017 N029 1Meg
R49 N057 N056 1Meg
R50 N058 N057 1Meg
R51 N059 N058 1Meg
R52 N060 N059 1Meg
L10 N061 N060 15n
R53 N031 N030 100
R54 N062 N061 100
L11 N018 N017 15n
R55 N019 N018 100
C53 N019 0 {par_cap}
L12 N076 N060 15n
R56 N077 N076 100
C54 N077 0 {par_cap}
R57 N054 N055 500
R58 N047 N046 500
R59 N046 0 500
R60 N055 N047 500
XU1 N062 N046 2.5V -2.5V N047 TLV354  ; pins In+ In- V+ V- OUT
XU2 N031 N055 2.5V -2.5V N054 TLV354  ; pins In+ In- V+ V- OUT
R1 N048 N044 10k
C1 N023 N001 10p
C2 N024 N023 10p
C3 N025 N024 10p
C4 N026 N025 10p
C5 N078 N063 10p
C6 N079 N078 10p
C7 N080 N079 10p
C8 N067 N080 10p
R2 N040 N037 10k
V3 N001 N041 0 AC 1
R3 N040 0 256
L1 N035 N026 15n
R5 N032 N001 1Meg
R6 N033 N032 1Meg
R7 N034 N033 1Meg
R8 N026 N034 1Meg
R9 N064 N063 1Meg
R10 N065 N064 1Meg
R11 N066 N065 1Meg
R12 N067 N066 1Meg
L3 N038 N037 15n
V9 N041 0 30
R4 0 N044 256
R22 N067 N048 92.308k
R21 N026 N037 100k
R23 N026 N037 1200k
C19 N026 N037 108.33p
C9 N037 0 975p
C10 N067 N048 110p
C11 N048 0 990p
V10 N041 N063 0 AC 1
R13 N002 N001 1Meg
R14 N003 N002 1Meg
R15 N004 N003 1Meg
R16 N005 N004 1Meg
R39 N098 N093 10k
C25 N082 N081 10p
C26 N083 N082 10p
C27 N084 N083 10p
C28 N085 N084 10p
C29 N099 N094 10p
C30 N100 N099 10p
C31 N101 N100 10p
C32 N098 N101 10p
C33 N085 0 55.5p
C34 N098 0 55.5p
R40 N091 N085 10k
C35 N085 0 470p
C36 N098 0 470p
R61 N091 0 25
R62 0 N093 25
C55 N085 0 470p
C56 N098 0 470p
R63 N088 N081 1Meg
R64 N089 N088 1Meg
R65 N090 N089 1Meg
R66 N085 N090 1Meg
R67 N095 N094 1Meg
R68 N096 N095 1Meg
R69 N097 N096 1Meg
R70 N098 N097 1Meg
L7 N086 N085 15n
R73 N087 N086 100
C59 N087 0 {par_cap}
L8 N102 N098 15n
R74 N103 N102 100
C60 N103 0 {par_cap}
V5 N081 N092 0 AC 1
V11 N092 N094 0 AC 1
R17 N053 N043 102k
C12 N007 N006 10p
C13 N008 N007 10p
C14 N009 N008 10p
C15 N010 N009 10p
C16 N068 N049 10p
C17 N069 N068 10p
C18 N070 N069 10p
C20 N053 N070 10p
R18 N036 N010 102k
C23 N010 0 47p
C24 N053 0 47p
R19 N036 0 560
R20 0 N043 560
C57 N010 0 47p
C58 N053 0 47p
R24 N020 N006 1Meg
R25 N021 N020 1Meg
R26 N022 N021 1Meg
R27 N010 N022 1Meg
R28 N050 N049 1Meg
R29 N051 N050 1Meg
R30 N052 N051 1Meg
R31 N053 N052 1Meg
L2 N011 N010 15n
R32 N012 N011 100
C61 N012 0 {par_cap}
L4 N071 N053 15n
R33 N072 N071 100
C62 N072 0 {par_cap}
V12 N006 N042 0 AC 1
V13 N042 N049 0 AC 1
;tran 1m
.param five=5
.param par_cap = 1p
* 1 / 400
* 82.5 dB CMRR at 100 kHz
.ac dec 100 100 100Meg
.lib TLV354.LIB
* 1 / 400
* 82.5 dB CMRR at 100 kHz
;ac dec 100 100 1000Meg
.lib TLV354.LIB
* 1 / 400
* 82.5 dB CMRR at 100 kHz
;ac dec 100 100 100Meg
* 1 / 400
* 82.5 dB CMRR at 100 kHz
;ac dec 100 100 100Meg
.backanno
.end